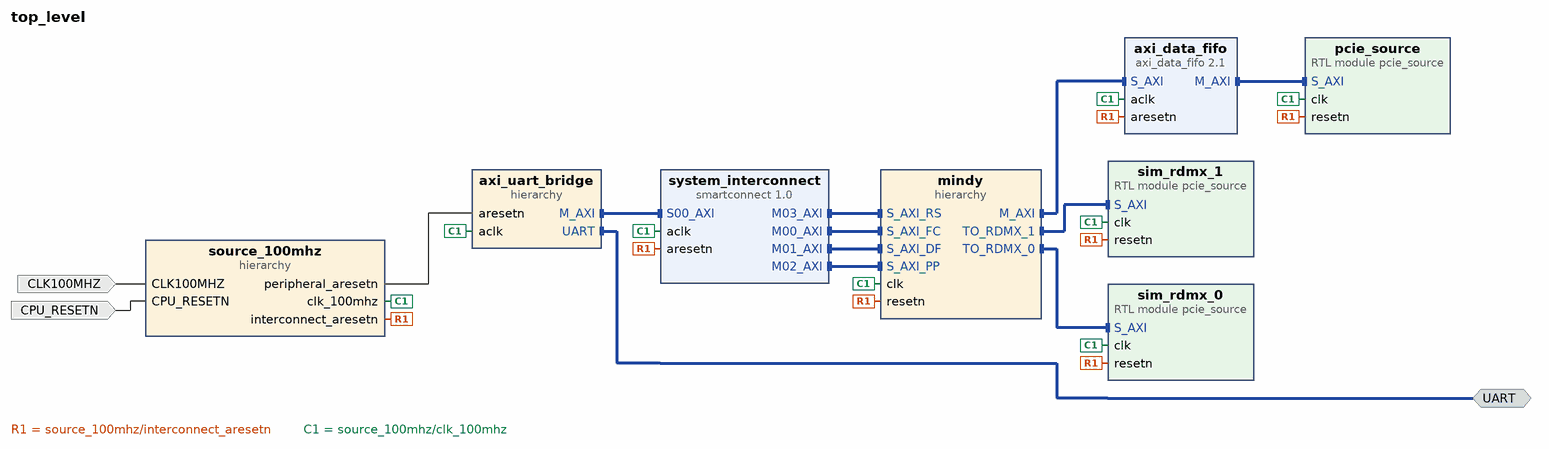
[diagram p0: block diagram of the top level]
# Vivado block design top_level, xc7a100tcsg324-1, Vivado 2021.1
create_bd_design top_level

create_bd_intf_port -mode Master -vlnv xilinx.com:interface:uart_rtl:1.0 UART
create_bd_port -dir I -type clk CLK100MHZ
set_property -dict {CONFIG.ASSOCIATED_RESET CPU_RESETN} [get_bd_ports CLK100MHZ]
create_bd_port -dir I -type rst CPU_RESETN

create_bd_cell -type ip -vlnv xilinx.com:ip:smartconnect:1.0 system_interconnect
set_property -dict {CONFIG.NUM_MI 4 CONFIG.NUM_SI 1} [get_bd_cells system_interconnect]
create_bd_cell -type hier source_100mhz
create_bd_cell -type hier axi_uart_bridge
create_bd_cell -type hier mindy
create_bd_cell -type ip -vlnv xilinx.com:ip:axi_data_fifo:2.1 axi_data_fifo
set_property -dict {CONFIG.READ_FIFO_DEPTH 32 CONFIG.WRITE_FIFO_DEPTH 32} [get_bd_cells axi_data_fifo]
create_bd_cell -type module -reference pcie_source pcie_source
create_bd_cell -type module -reference pcie_source sim_rdmx_0
create_bd_cell -type module -reference pcie_source sim_rdmx_1

# ---- hierarchy /source_100mhz ----
current_bd_instance /source_100mhz
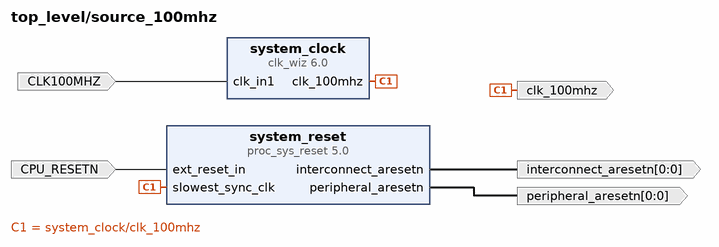
[diagram p1: block diagram inside /source_100mhz]
create_bd_pin -dir I -type clk CLK100MHZ
create_bd_pin -dir O -type clk clk_100mhz
create_bd_pin -dir I -type rst CPU_RESETN
create_bd_pin -dir O -from 0 -to 0 -type rst interconnect_aresetn
create_bd_pin -dir O -from 0 -to 0 -type rst peripheral_aresetn

create_bd_cell -type ip -vlnv xilinx.com:ip:clk_wiz:6.0 system_clock
set_property -dict [list \
  CONFIG.CLKOUT1_DRIVES BUFGCE \
  CONFIG.CLKOUT1_JITTER 151.636 \
  CONFIG.CLKOUT1_REQUESTED_OUT_FREQ 50 \
  CONFIG.CLKOUT2_DRIVES BUFGCE \
  CONFIG.CLKOUT3_DRIVES BUFGCE \
  CONFIG.CLKOUT4_DRIVES BUFGCE \
  CONFIG.CLKOUT5_DRIVES BUFGCE \
  CONFIG.CLKOUT6_DRIVES BUFGCE \
  CONFIG.CLKOUT7_DRIVES BUFGCE \
  CONFIG.CLK_OUT1_PORT clk_100mhz \
  CONFIG.FEEDBACK_SOURCE FDBK_AUTO \
  CONFIG.MMCM_CLKOUT0_DIVIDE_F 20.000 \
  CONFIG.USE_LOCKED false \
  CONFIG.USE_RESET false \
  CONFIG.USE_SAFE_CLOCK_STARTUP true \
] [get_bd_cells system_clock]
create_bd_cell -type ip -vlnv xilinx.com:ip:proc_sys_reset:5.0 system_reset

# ---- hierarchy /axi_uart_bridge ----
current_bd_instance /axi_uart_bridge
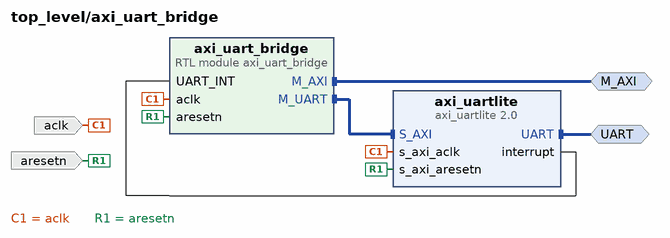
[diagram p2: block diagram inside /axi_uart_bridge]
create_bd_intf_pin -mode Master -vlnv xilinx.com:interface:aximm_rtl:1.0 M_AXI
create_bd_intf_pin -mode Master -vlnv xilinx.com:interface:uart_rtl:1.0 UART
create_bd_pin -dir I -type rst aresetn
create_bd_pin -dir I -type clk aclk

create_bd_cell -type ip -vlnv xilinx.com:ip:axi_uartlite:2.0 axi_uartlite
set_property -dict {CONFIG.C_BAUDRATE 115200} [get_bd_cells axi_uartlite]
create_bd_cell -type module -reference axi_uart_bridge axi_uart_bridge

# ---- hierarchy /mindy ----
current_bd_instance /mindy
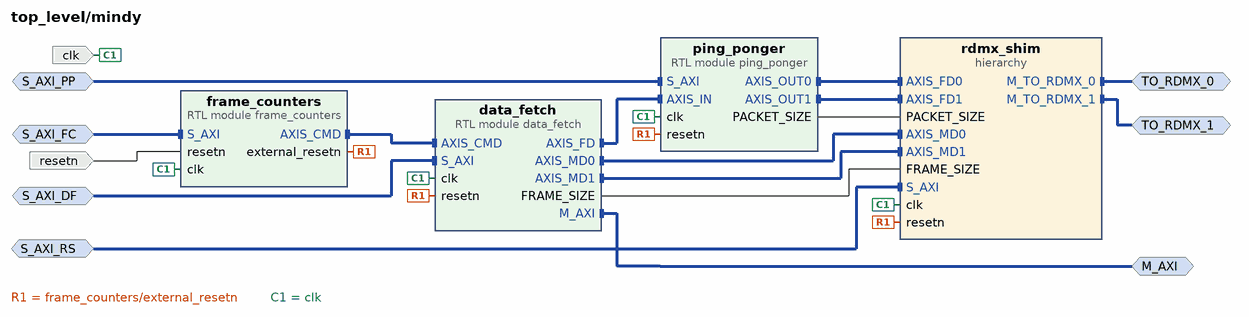
[diagram p3: block diagram inside /mindy]
create_bd_intf_pin -mode Slave -vlnv xilinx.com:interface:aximm_rtl:1.0 S_AXI_FC
create_bd_intf_pin -mode Master -vlnv xilinx.com:interface:aximm_rtl:1.0 M_AXI
create_bd_intf_pin -mode Slave -vlnv xilinx.com:interface:aximm_rtl:1.0 S_AXI_DF
create_bd_intf_pin -mode Slave -vlnv xilinx.com:interface:aximm_rtl:1.0 S_AXI_PP
create_bd_intf_pin -mode Slave -vlnv xilinx.com:interface:aximm_rtl:1.0 S_AXI_RS
create_bd_intf_pin -mode Master -vlnv xilinx.com:interface:aximm_rtl:1.0 TO_RDMX_1
create_bd_intf_pin -mode Master -vlnv xilinx.com:interface:aximm_rtl:1.0 TO_RDMX_0
create_bd_pin -dir I -type clk clk
create_bd_pin -dir I -type rst resetn

create_bd_cell -type module -reference ping_ponger ping_ponger
create_bd_cell -type hier rdmx_shim
create_bd_cell -type module -reference frame_counters frame_counters
create_bd_cell -type module -reference data_fetch data_fetch
set_property -dict {CONFIG.FD_FIFO_DEPTH 16 CONFIG.FD_FIFO_TYPE distributed} [get_bd_cells data_fetch]

# ---- hierarchy /mindy/rdmx_shim ----
current_bd_instance /mindy/rdmx_shim
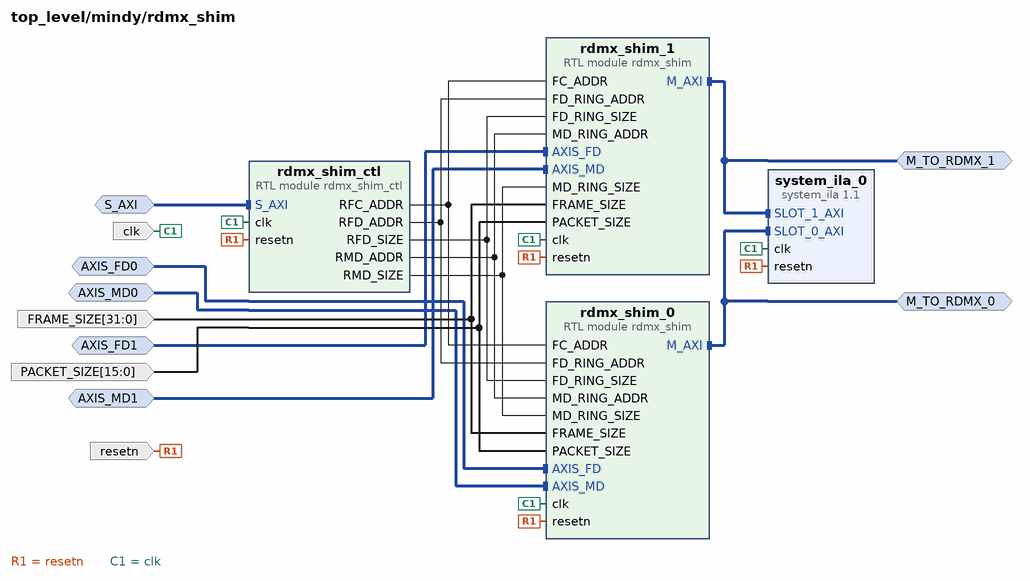
[diagram p4: block diagram inside /mindy/rdmx_shim]
create_bd_intf_pin -mode Slave -vlnv xilinx.com:interface:axis_rtl:1.0 AXIS_FD0
create_bd_intf_pin -mode Slave -vlnv xilinx.com:interface:axis_rtl:1.0 AXIS_MD1
create_bd_intf_pin -mode Slave -vlnv xilinx.com:interface:axis_rtl:1.0 AXIS_FD1
create_bd_intf_pin -mode Slave -vlnv xilinx.com:interface:axis_rtl:1.0 AXIS_MD0
create_bd_intf_pin -mode Slave -vlnv xilinx.com:interface:aximm_rtl:1.0 S_AXI
create_bd_intf_pin -mode Master -vlnv xilinx.com:interface:aximm_rtl:1.0 M_TO_RDMX_1
create_bd_intf_pin -mode Master -vlnv xilinx.com:interface:aximm_rtl:1.0 M_TO_RDMX_0
create_bd_pin -dir I -type clk clk
create_bd_pin -dir I -type rst resetn
create_bd_pin -dir I -from 15 -to 0 PACKET_SIZE
create_bd_pin -dir I -from 31 -to 0 FRAME_SIZE

create_bd_cell -type ip -vlnv xilinx.com:ip:system_ila:1.1 system_ila_0
set_property -dict {CONFIG.C_NUM_MONITOR_SLOTS 2} [get_bd_cells system_ila_0]
create_bd_cell -type module -reference rdmx_shim_ctl rdmx_shim_ctl
create_bd_cell -type module -reference rdmx_shim rdmx_shim_0
create_bd_cell -type module -reference rdmx_shim rdmx_shim_1

# ---- connections ----

current_bd_instance /source_100mhz
connect_bd_net [get_bd_pins CLK100MHZ] [get_bd_pins system_clock/clk_in1]
connect_bd_net [get_bd_pins CPU_RESETN] [get_bd_pins system_reset/ext_reset_in]
connect_bd_net [get_bd_pins system_clock/clk_100mhz] [get_bd_pins clk_100mhz] [get_bd_pins system_reset/slowest_sync_clk]
connect_bd_net [get_bd_pins system_reset/interconnect_aresetn] [get_bd_pins interconnect_aresetn]
connect_bd_net [get_bd_pins system_reset/peripheral_aresetn] [get_bd_pins peripheral_aresetn]

current_bd_instance /axi_uart_bridge
connect_bd_intf_net [get_bd_intf_pins M_AXI] [get_bd_intf_pins axi_uart_bridge/M_AXI]
connect_bd_intf_net [get_bd_intf_pins UART] [get_bd_intf_pins axi_uartlite/UART]
connect_bd_intf_net [get_bd_intf_pins axi_uart_bridge/M_UART] [get_bd_intf_pins axi_uartlite/S_AXI]
connect_bd_net [get_bd_pins aclk] [get_bd_pins axi_uartlite/s_axi_aclk] [get_bd_pins axi_uart_bridge/aclk]
connect_bd_net [get_bd_pins aresetn] [get_bd_pins axi_uartlite/s_axi_aresetn] [get_bd_pins axi_uart_bridge/aresetn]
connect_bd_net [get_bd_pins axi_uartlite/interrupt] [get_bd_pins axi_uart_bridge/UART_INT]

current_bd_instance /mindy
connect_bd_intf_net -intf_net AXIS_FD0_1 [get_bd_intf_pins rdmx_shim/AXIS_FD0] [get_bd_intf_pins ping_ponger/AXIS_OUT0]
connect_bd_intf_net -intf_net AXIS_FD1_1 [get_bd_intf_pins rdmx_shim/AXIS_FD1] [get_bd_intf_pins ping_ponger/AXIS_OUT1]
connect_bd_intf_net [get_bd_intf_pins S_AXI_PP] [get_bd_intf_pins ping_ponger/S_AXI]
connect_bd_intf_net [get_bd_intf_pins S_AXI_RS] [get_bd_intf_pins rdmx_shim/S_AXI]
connect_bd_intf_net [get_bd_intf_pins TO_RDMX_1] [get_bd_intf_pins rdmx_shim/M_TO_RDMX_1]
connect_bd_intf_net [get_bd_intf_pins TO_RDMX_0] [get_bd_intf_pins rdmx_shim/M_TO_RDMX_0]
connect_bd_intf_net [get_bd_intf_pins data_fetch/AXIS_FD] [get_bd_intf_pins ping_ponger/AXIS_IN]
connect_bd_intf_net [get_bd_intf_pins data_fetch/AXIS_MD0] [get_bd_intf_pins rdmx_shim/AXIS_MD0]
connect_bd_intf_net [get_bd_intf_pins rdmx_shim/AXIS_MD1] [get_bd_intf_pins data_fetch/AXIS_MD1]
connect_bd_intf_net [get_bd_intf_pins M_AXI] [get_bd_intf_pins data_fetch/M_AXI]
connect_bd_intf_net [get_bd_intf_pins frame_counters/AXIS_CMD] [get_bd_intf_pins data_fetch/AXIS_CMD]
connect_bd_intf_net -intf_net system_interconnect_M00_AXI [get_bd_intf_pins S_AXI_FC] [get_bd_intf_pins frame_counters/S_AXI]
connect_bd_intf_net -intf_net system_interconnect_M01_AXI [get_bd_intf_pins S_AXI_DF] [get_bd_intf_pins data_fetch/S_AXI]
connect_bd_net [get_bd_pins data_fetch/FRAME_SIZE] [get_bd_pins rdmx_shim/FRAME_SIZE]
connect_bd_net [get_bd_pins frame_counters/external_resetn] \
  [get_bd_pins ping_ponger/resetn] [get_bd_pins rdmx_shim/resetn] [get_bd_pins data_fetch/resetn]
connect_bd_net [get_bd_pins ping_ponger/PACKET_SIZE] [get_bd_pins rdmx_shim/PACKET_SIZE]
connect_bd_net -net source_100mhz_interconnect_aresetn [get_bd_pins resetn] [get_bd_pins frame_counters/resetn]
connect_bd_net -net system_clock_clk_100mhz [get_bd_pins clk] \
  [get_bd_pins ping_ponger/clk] [get_bd_pins rdmx_shim/clk] [get_bd_pins frame_counters/clk] [get_bd_pins data_fetch/clk]

current_bd_instance /mindy/rdmx_shim
connect_bd_intf_net -intf_net AXIS_FD0_1 [get_bd_intf_pins AXIS_FD0] [get_bd_intf_pins rdmx_shim_0/AXIS_FD]
connect_bd_intf_net -intf_net AXIS_FD1_1 [get_bd_intf_pins AXIS_FD1] [get_bd_intf_pins rdmx_shim_1/AXIS_FD]
connect_bd_intf_net -intf_net Channel_0 [get_bd_intf_pins M_TO_RDMX_0] [get_bd_intf_pins rdmx_shim_0/M_AXI]
connect_bd_intf_net [get_bd_intf_pins M_TO_RDMX_0] [get_bd_intf_pins system_ila_0/SLOT_0_AXI]
connect_bd_intf_net -intf_net Channel_1 [get_bd_intf_pins M_TO_RDMX_1] [get_bd_intf_pins rdmx_shim_1/M_AXI]
connect_bd_intf_net [get_bd_intf_pins M_TO_RDMX_1] [get_bd_intf_pins system_ila_0/SLOT_1_AXI]
connect_bd_intf_net [get_bd_intf_pins S_AXI] [get_bd_intf_pins rdmx_shim_ctl/S_AXI]
connect_bd_intf_net -intf_net data_fetch_AXIS_MD0 [get_bd_intf_pins AXIS_MD0] [get_bd_intf_pins rdmx_shim_0/AXIS_MD]
connect_bd_intf_net -intf_net data_fetch_AXIS_MD1 [get_bd_intf_pins AXIS_MD1] [get_bd_intf_pins rdmx_shim_1/AXIS_MD]
connect_bd_net -net data_fetch_FRAME_SIZE [get_bd_pins FRAME_SIZE] [get_bd_pins rdmx_shim_0/FRAME_SIZE] [get_bd_pins rdmx_shim_1/FRAME_SIZE]
connect_bd_net -net frame_counters_external_resetn [get_bd_pins resetn] \
  [get_bd_pins system_ila_0/resetn] [get_bd_pins rdmx_shim_ctl/resetn] [get_bd_pins rdmx_shim_0/resetn] \
  [get_bd_pins rdmx_shim_1/resetn]
connect_bd_net -net ping_ponger_PACKET_SIZE [get_bd_pins PACKET_SIZE] [get_bd_pins rdmx_shim_0/PACKET_SIZE] [get_bd_pins rdmx_shim_1/PACKET_SIZE]
connect_bd_net -net rdmx_shim_ctl_0_RFC_ADDR [get_bd_pins rdmx_shim_ctl/RFC_ADDR] [get_bd_pins rdmx_shim_0/FC_ADDR] [get_bd_pins rdmx_shim_1/FC_ADDR]
connect_bd_net -net rdmx_shim_ctl_0_RFD_ADDR [get_bd_pins rdmx_shim_ctl/RFD_ADDR] \
  [get_bd_pins rdmx_shim_0/FD_RING_ADDR] [get_bd_pins rdmx_shim_1/FD_RING_ADDR]
connect_bd_net -net rdmx_shim_ctl_0_RFD_SIZE [get_bd_pins rdmx_shim_ctl/RFD_SIZE] \
  [get_bd_pins rdmx_shim_0/FD_RING_SIZE] [get_bd_pins rdmx_shim_1/FD_RING_SIZE]
connect_bd_net -net rdmx_shim_ctl_0_RMD_ADDR [get_bd_pins rdmx_shim_ctl/RMD_ADDR] \
  [get_bd_pins rdmx_shim_0/MD_RING_ADDR] [get_bd_pins rdmx_shim_1/MD_RING_ADDR]
connect_bd_net -net rdmx_shim_ctl_0_RMD_SIZE [get_bd_pins rdmx_shim_ctl/RMD_SIZE] \
  [get_bd_pins rdmx_shim_0/MD_RING_SIZE] [get_bd_pins rdmx_shim_1/MD_RING_SIZE]
connect_bd_net -net system_clock_clk_100mhz [get_bd_pins clk] \
  [get_bd_pins system_ila_0/clk] [get_bd_pins rdmx_shim_ctl/clk] [get_bd_pins rdmx_shim_0/clk] [get_bd_pins rdmx_shim_1/clk]

current_bd_instance /
connect_bd_intf_net [get_bd_intf_pins mindy/S_AXI_RS] [get_bd_intf_pins system_interconnect/M03_AXI]
connect_bd_intf_net -intf_net axi_data_fifo_0_M_AXI [get_bd_intf_pins axi_data_fifo/M_AXI] [get_bd_intf_pins pcie_source/S_AXI]
connect_bd_intf_net -intf_net hier_0_M_AXI [get_bd_intf_pins system_interconnect/S00_AXI] [get_bd_intf_pins axi_uart_bridge/M_AXI]
connect_bd_intf_net -intf_net hier_0_UART [get_bd_intf_ports UART] [get_bd_intf_pins axi_uart_bridge/UART]
connect_bd_intf_net [get_bd_intf_pins axi_data_fifo/S_AXI] [get_bd_intf_pins mindy/M_AXI]
connect_bd_intf_net [get_bd_intf_pins sim_rdmx_0/S_AXI] [get_bd_intf_pins mindy/TO_RDMX_0]
connect_bd_intf_net [get_bd_intf_pins sim_rdmx_1/S_AXI] [get_bd_intf_pins mindy/TO_RDMX_1]
connect_bd_intf_net [get_bd_intf_pins mindy/S_AXI_FC] [get_bd_intf_pins system_interconnect/M00_AXI]
connect_bd_intf_net [get_bd_intf_pins system_interconnect/M01_AXI] [get_bd_intf_pins mindy/S_AXI_DF]
connect_bd_intf_net [get_bd_intf_pins system_interconnect/M02_AXI] [get_bd_intf_pins mindy/S_AXI_PP]
connect_bd_net [get_bd_ports CLK100MHZ] [get_bd_pins source_100mhz/CLK100MHZ]
connect_bd_net [get_bd_ports CPU_RESETN] [get_bd_pins source_100mhz/CPU_RESETN]
connect_bd_net [get_bd_pins source_100mhz/interconnect_aresetn] \
  [get_bd_pins system_interconnect/aresetn] [get_bd_pins mindy/resetn] [get_bd_pins axi_data_fifo/aresetn] \
  [get_bd_pins pcie_source/resetn] [get_bd_pins sim_rdmx_1/resetn] [get_bd_pins sim_rdmx_0/resetn]
connect_bd_net [get_bd_pins source_100mhz/peripheral_aresetn] [get_bd_pins axi_uart_bridge/aresetn]
connect_bd_net -net system_clock_clk_100mhz [get_bd_pins source_100mhz/clk_100mhz] \
  [get_bd_pins system_interconnect/aclk] [get_bd_pins axi_uart_bridge/aclk] [get_bd_pins mindy/clk] \
  [get_bd_pins axi_data_fifo/aclk] [get_bd_pins pcie_source/clk] [get_bd_pins sim_rdmx_0/clk] [get_bd_pins sim_rdmx_1/clk]

# ---- address map ----
assign_bd_address -offset 0x0000000000001000 -range 128 -target_address_space [get_bd_addr_spaces axi_uart_bridge/axi_uart_bridge/M_AXI] [get_bd_addr_segs mindy/frame_counters/S_AXI/reg0]
assign_bd_address -offset 0x0000000000002000 -range 128 -target_address_space [get_bd_addr_spaces axi_uart_bridge/axi_uart_bridge/M_AXI] [get_bd_addr_segs mindy/data_fetch/S_AXI/reg0]
assign_bd_address -offset 0x0000000000003000 -range 128 -target_address_space [get_bd_addr_spaces axi_uart_bridge/axi_uart_bridge/M_AXI] [get_bd_addr_segs mindy/ping_ponger/S_AXI/reg0]
assign_bd_address -offset 0x0000000000004000 -range 128 -target_address_space [get_bd_addr_spaces axi_uart_bridge/axi_uart_bridge/M_AXI] [get_bd_addr_segs mindy/rdmx_shim/rdmx_shim_ctl/S_AXI/reg0]
assign_bd_address -offset 0x40600000 -range 64K -target_address_space [get_bd_addr_spaces axi_uart_bridge/axi_uart_bridge/M_UART] [get_bd_addr_segs axi_uart_bridge/axi_uartlite/S_AXI/Reg]
assign_bd_address -offset 0x0000000000000000 -range 16E -target_address_space [get_bd_addr_spaces mindy/data_fetch/M_AXI] [get_bd_addr_segs pcie_source/S_AXI/reg0]
assign_bd_address -offset 0x0000000000000000 -range 16E -target_address_space [get_bd_addr_spaces mindy/rdmx_shim/rdmx_shim_0/M_AXI] [get_bd_addr_segs sim_rdmx_0/S_AXI/reg0]
assign_bd_address -offset 0x0000000000000000 -range 16E -target_address_space [get_bd_addr_spaces mindy/rdmx_shim/rdmx_shim_1/M_AXI] [get_bd_addr_segs sim_rdmx_1/S_AXI/reg0]

validate_bd_design
save_bd_design
